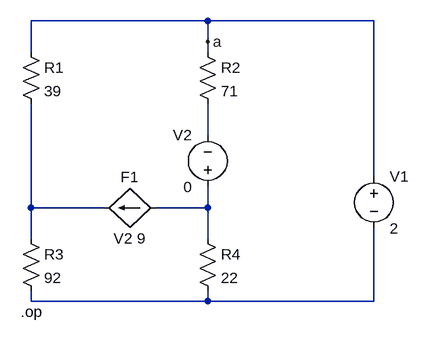
[diagram p0: schematic E2.asc]
E2.asc, the LTspice schematic file:
Version 4.1
SHEET 1 880 680
WIRE 240 -64 -32 -64
WIRE 496 -64 240 -64
WIRE 240 -32 240 -64
WIRE -32 -16 -32 -64
WIRE 240 -16 240 -32
WIRE 240 112 240 64
WIRE 496 176 496 -64
WIRE -32 224 -32 64
WIRE 80 224 -32 224
WIRE 240 224 240 192
WIRE 240 224 160 224
WIRE -32 272 -32 224
WIRE 240 272 240 224
WIRE -32 368 -32 352
WIRE 240 368 240 352
WIRE 240 368 -32 368
WIRE 496 368 496 256
WIRE 496 368 240 368
FLAG 240 -32 a
SYMBOL res -48 -32 R0
SYMATTR InstName R1
SYMATTR Value 39
SYMBOL res 224 -32 R0
SYMATTR InstName R2
SYMATTR Value 71
SYMBOL res -48 256 R0
SYMATTR InstName R3
SYMATTR Value 92
SYMBOL res 224 256 R0
SYMATTR InstName R4
SYMATTR Value 22
SYMBOL f 160 224 R90
WINDOW 0 -32 40 VBottom 2
WINDOW 3 32 40 VTop 2
SYMATTR InstName F1
SYMATTR Value V2 9
SYMBOL voltage 496 160 R0
WINDOW 123 0 0 Left 0
WINDOW 39 0 0 Left 0
SYMATTR InstName V1
SYMATTR Value 2
SYMBOL voltage 240 208 R180
WINDOW 0 24 96 Left 2
WINDOW 3 24 16 Left 2
WINDOW 123 0 0 Left 0
WINDOW 39 0 0 Left 0
SYMATTR InstName V2
SYMATTR Value 0
TEXT -48 384 Left 2 !.op

The netlist it stands for:
* E2.asc
R1 a N002 39
R2 a N001 71
R3 N002 N004 92
R4 N003 N004 22
F1 N003 N002 V2 9
V1 a N004 2
V2 N003 N001 0
.op
.backanno
.end